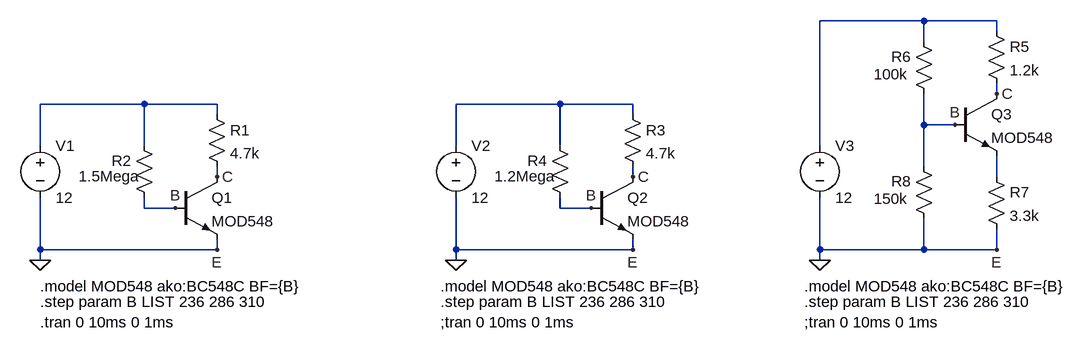
[diagram p0: schematic CircuitoQuintaParte.asc]
CircuitoQuintaParte.asc, the LTspice schematic file:
Version 4
SHEET 1 1592 680
WIRE 1344 -128 1184 -128
WIRE 1456 -128 1344 -128
WIRE 1456 -112 1456 -128
WIRE 1344 -96 1344 -128
WIRE 1456 -16 1456 -32
WIRE 144 0 -16 0
WIRE 256 0 144 0
WIRE 784 0 624 0
WIRE 896 0 784 0
WIRE 256 16 256 0
WIRE 896 16 896 0
WIRE 1344 32 1344 -16
WIRE 1392 32 1344 32
WIRE -16 64 -16 0
WIRE 144 64 144 0
WIRE 624 64 624 0
WIRE 784 64 784 0
WIRE 1184 64 1184 -128
WIRE 1344 96 1344 32
WIRE 256 112 256 96
WIRE 896 112 896 96
WIRE 1456 112 1456 80
WIRE 144 160 144 144
WIRE 192 160 144 160
WIRE 784 160 784 144
WIRE 832 160 784 160
WIRE -16 224 -16 144
WIRE 256 224 256 208
WIRE 256 224 -16 224
WIRE 624 224 624 144
WIRE 896 224 896 208
WIRE 896 224 624 224
WIRE 1184 224 1184 144
WIRE 1344 224 1344 176
WIRE 1344 224 1184 224
WIRE 1456 224 1456 192
WIRE 1456 224 1344 224
WIRE -16 240 -16 224
WIRE 624 240 624 224
WIRE 1184 240 1184 224
FLAG 256 112 C
FLAG 192 160 B
FLAG 256 224 E
FLAG -16 240 0
FLAG 896 112 C
FLAG 832 160 B
FLAG 896 224 E
FLAG 624 240 0
FLAG 1456 -16 C
FLAG 1392 32 B
FLAG 1456 224 E
FLAG 1184 240 0
SYMBOL npn 192 112 R0
SYMATTR InstName Q1
SYMATTR Value MOD548
SYMBOL res 240 0 R0
SYMATTR InstName R1
SYMATTR Value 4.7k
SYMBOL res 128 48 R0
WINDOW 0 -34 39 Left 2
WINDOW 3 -85 63 Left 2
SYMATTR InstName R2
SYMATTR Value 1.5Mega
SYMBOL voltage -16 48 R0
WINDOW 123 0 0 Left 0
WINDOW 39 0 0 Left 0
SYMATTR InstName V1
SYMATTR Value 12
SYMBOL npn 832 112 R0
SYMATTR InstName Q2
SYMATTR Value MOD548
SYMBOL res 880 0 R0
SYMATTR InstName R3
SYMATTR Value 4.7k
SYMBOL res 768 48 R0
WINDOW 0 -34 39 Left 2
WINDOW 3 -85 63 Left 2
SYMATTR InstName R4
SYMATTR Value 1.2Mega
SYMBOL voltage 624 48 R0
WINDOW 123 0 0 Left 0
WINDOW 39 0 0 Left 0
SYMATTR InstName V2
SYMATTR Value 12
SYMBOL npn 1392 -16 R0
SYMATTR InstName Q3
SYMATTR Value MOD548
SYMBOL res 1440 -128 R0
SYMATTR InstName R5
SYMATTR Value 1.2k
SYMBOL res 1328 -112 R0
WINDOW 0 -34 39 Left 2
WINDOW 3 -61 66 Left 2
SYMATTR InstName R6
SYMATTR Value 100k
SYMBOL voltage 1184 48 R0
WINDOW 123 0 0 Left 0
WINDOW 39 0 0 Left 0
SYMATTR InstName V3
SYMATTR Value 12
SYMBOL res 1440 96 R0
SYMATTR InstName R7
SYMATTR Value 3.3k
SYMBOL res 1328 80 R0
WINDOW 0 -34 39 Left 2
WINDOW 3 -61 66 Left 2
SYMATTR InstName R8
SYMATTR Value 150k
TEXT -16 280 Left 2 !.model MOD548 ako:BC548C BF={B}
TEXT -16 304 Left 2 !.step param B LIST 236 286 310
TEXT -16 336 Left 2 !.tran 0 10ms 0 1ms
TEXT 600 280 Left 2 !.model MOD548 ako:BC548C BF={B}
TEXT 600 304 Left 2 !.step param B LIST 236 286 310
TEXT 600 336 Left 2 !;tran 0 10ms 0 1ms
TEXT 1160 280 Left 2 !.model MOD548 ako:BC548C BF={B}
TEXT 1160 304 Left 2 !.step param B LIST 236 286 310
TEXT 1160 336 Left 2 !;tran 0 10ms 0 1ms

The netlist it stands for:
* CircuitoQuintaParte.asc
Q1 C B 0 0 MOD548
R1 N002 C 4.7k
R2 N002 B 1.5Mega
V1 N002 0 12
Q2 C B 0 0 MOD548
R3 N003 C 4.7k
R4 N003 B 1.2Mega
V2 N003 0 12
Q3 C B N004 0 MOD548
R5 N001 C 1.2k
R6 N001 B 100k
V3 N001 0 12
R7 N004 0 3.3k
R8 B 0 150k
.model NPN NPN
.model PNP PNP
.lib standard.bjt
.model MOD548 ako:BC548C BF={B}
.step param B LIST 236 286 310
.tran 0 10ms 0 1ms
.model MOD548 ako:BC548C BF={B}
.step param B LIST 236 286 310
;tran 0 10ms 0 1ms
.model MOD548 ako:BC548C BF={B}
.step param B LIST 236 286 310
;tran 0 10ms 0 1ms
.backanno
.end